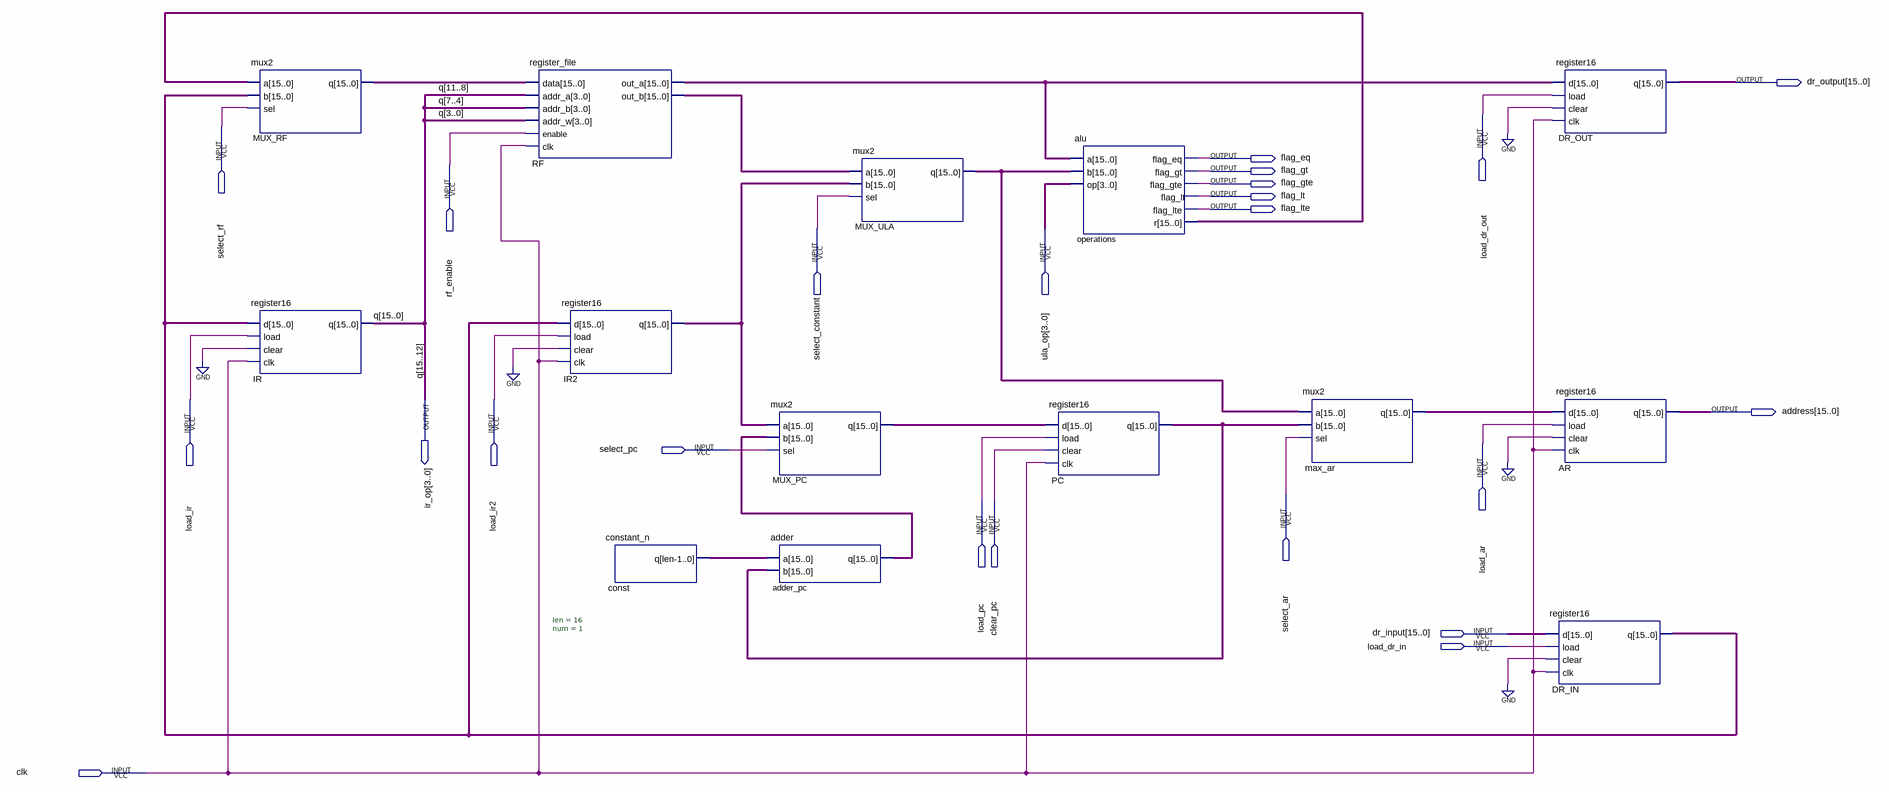
[diagram p0: schematic sheet]
// Quartus schematic data_path.bdf as structural Verilog: 14 symbols, 23 pins
module data_path (
  input  load_dr_out,
  input  select_rf,
  input  rf_enable,
  input  select_constant,
  input  [3:0] ula_op,
  input  load_ir,
  input  load_ir2,
  input  load_ar,
  input  select_pc,
  input  select_ar,
  input  load_pc,
  input  clear_pc,
  input  [15:0] dr_input,
  input  load_dr_in,
  input  clk,
  output [15:0] dr_output,
  output flag_eq,
  output flag_gt,
  output flag_gte,
  output flag_lt,
  output flag_lte,
  output [3:0] ir_op,
  output [15:0] address
);

  wire [11:0] q;
  wire [15:0] adder_pc_q, const_q, DR_IN_q, IR2_q, max_ar_q, MUX_PC_q, MUX_RF_q, MUX_ULA_q, operations_r,
       PC_q, RF_out_a, RF_out_b;

  mux2 MUX_RF (.a(operations_r), .b(DR_IN_q), .sel(select_rf), .q(MUX_RF_q));
  register16 IR (.d(DR_IN_q), .load(load_ir), .clear(1'b0), .clk(clk), .q({ir_op, q}));
  register_file RF (
    .data(MUX_RF_q), .addr_a(q[11:8]), .addr_b(q[7:4]), .addr_w(q[3:0]), .enable(rf_enable), .clk(clk),
    .out_a(RF_out_a), .out_b(RF_out_b));
  register16 IR2 (.d(DR_IN_q), .load(load_ir2), .clear(1'b0), .clk(clk), .q(IR2_q));
  constant_n #(.len(16), .num(1)) \const  (.q(const_q));
  mux2 MUX_PC (.a(IR2_q), .b(adder_pc_q), .sel(select_pc), .q(MUX_PC_q));
  adder adder_pc (.a(const_q), .b(PC_q), .q(adder_pc_q));
  mux2 MUX_ULA (.a(RF_out_b), .b(IR2_q), .sel(select_constant), .q(MUX_ULA_q));
  alu operations (
    .a(RF_out_a), .b(MUX_ULA_q), .op(ula_op), .flag_eq(flag_eq), .flag_gt(flag_gt), .flag_gte(flag_gte),
    .flag_lt(flag_lt), .flag_lte(flag_lte), .r(operations_r));
  register16 PC (.d(MUX_PC_q), .load(load_pc), .clear(clear_pc), .clk(clk), .q(PC_q));
  mux2 max_ar (.a(MUX_ULA_q), .b(PC_q), .sel(select_ar), .q(max_ar_q));
  register16 DR_IN (.d(dr_input), .load(load_dr_in), .clear(1'b0), .clk(clk), .q(DR_IN_q));
  register16 DR_OUT (.d(RF_out_a), .load(load_dr_out), .clear(1'b0), .clk(clk), .q(dr_output));
  register16 AR (.d(max_ar_q), .load(load_ar), .clear(1'b0), .clk(clk), .q(address));

  // Other names for the same wires on the sheet: q[15:12] = ir_op
endmodule
